# Altium project Programming Dongle.PrjPcb
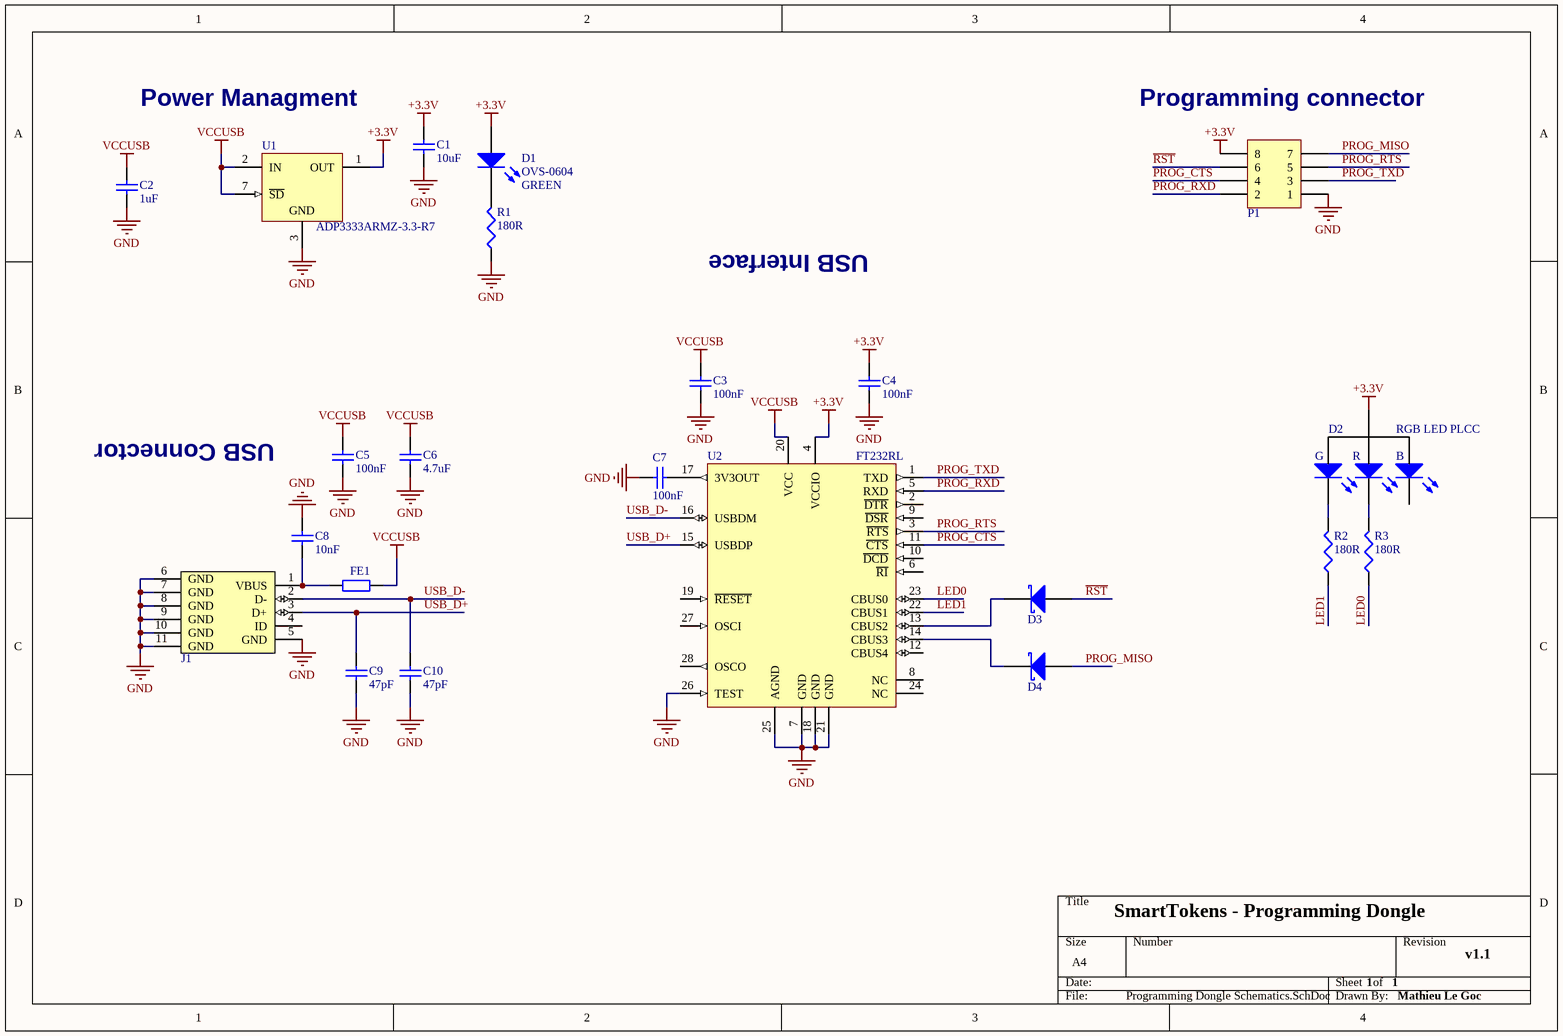
[diagram p0: Programming Dongle Schematics.SchDoc]
1 sheet, 22 parts. Net scope: global (net labels, ports and power ports of the same name join across sheets).
Board file: Programming Dongle PCB.PcbDoc

## Sheet Programming Dongle Schematics.SchDoc: SmartTokens - Programming Dongle
size A4; Author: Mathieu Le Goc; DrawnBy: Mathieu Le Goc; DocumentNumber: 1; Revision: v1.1; SheetNumber: 1; SheetTotal: 1; PageSetup: Record=PageOptions|CenterHorizontal=True|CenterVertical=True|PrintScale=1.04|XCorrection=1.00|YCorrection=1.00|PrintKind=1|BorderSize=5000000|LeftOffset=0|BottomOffset=0|Orientation=2|PaperLength=1000|PaperWidth=1000|Scale=100|PaperSource=7|PrintQuality=-4|MediaType=1|DitherType=10|PrintScaleMode=1|PaperKind=A4|PaperIndex=9

### Parts
C1  value 10uF  [0603]  (hidden comment: 10uF 0603 X5R 6.3V AVX)
C2  value 1uF  [0603]  (hidden comment: 1uF 0603 X5R 10V MULTICOMP)
C3  value 100nF  [0402]  (hidden comment: 100nF 0402 X7R 16V ±10%)
C4  value 100nF  [0402]  (hidden comment: 100nF 0402 X7R 16V ±10%)
C5  value 100nF  [0402]  (hidden comment: 100nF 0402 X7R 16V ±10%)
C6  value 4.7uF  [0603]  (hidden comment: 4.7uF 0603 X5R 10V KEMET)
C7  value 100nF  [0402]  (hidden comment: 100nF 0402 X7R 16V ±10%)
C8  value 10nF  [0402]  (hidden comment: 10nF 0402 X7R 25V KEMET)
C9  value 47pF  [0402]  (hidden comment: 47pF 0402 NP0 50V MURATA)
C10  value 47pF  [0402]  (hidden comment: 47pF 0402 NP0 50V MURATA)
D1  OVS-0604  value GREEN  [0603 - LED]
D2  RGB LED PLCC  [PLCC_4]
D3  Schottky barrier single diode  [SOD-323]  (value not drawn)
D4  Schottky barrier single diode  [SOD-323]  (value not drawn)
FE1  MURATA - BLM18PG471SN1D  [0603]  (value not drawn)
J1  MICRO USB B  [MICRO_USB_B]  (value not drawn)
P1  FTSH-104-04-F-DH  [FTSH-104-04-F-DH]  (value not drawn)
R1  value 180R  [0402]  (hidden comment: 180R 0402 1% VISHAY)
R2  value 180R  [0402]  (hidden comment: 180R 0402 1/16W ±1%)
R3  value 180R  [0402]  (hidden comment: 180R 0402 1/16W ±1%)
U1  ADP3333ARMZ-3.3-R7  [ADI-RM-8_N]
U2  FT232RL  [SSOP-28_N]

### Nets
+3.3V: C1.2 C4.2 D1.1(A) D2.3(A) P1.8 U1.1(OUT) U2.4(VCCIO)
GND: C1.1 C2.1 C3.1 C4.1 C5.1 C6.1 C7.2 C8.2 C9.1 C10.1 J1.5(GND) J1.6(GND) J1.7(GND) J1.8(GND) J1.9(GND) J1.10(GND) J1.11(GND) P1.1 R1.1 U1.3(GND) U1.4(NC) U1.5(NC) U1.6(NC) U1.8(NC) U2.7(GND) U2.18(GND) U2.21(GND) U2.25(AGND) U2.26(TEST)
VCCUSB: C2.2 C3.2 C5.2 C6.2 FE1.2 U1.2(IN) U1.7(~{SD}) U2.20(VCC)
LED0: R3.1 U2.23(CBUS0)
LED1: R2.1 U2.22(CBUS1)
PROG_CTS: P1.4 U2.11(~{CTS})
PROG_MISO: D4.2(A) P1.7
PROG_RTS: P1.5 U2.3(~{RTS})
PROG_RXD: P1.2 U2.5(RXD)
PROG_TXD: P1.3 U2.1(TXD)
~{RST}: D3.2(A) P1.6
USB_D+: C9.2 J1.3(D+) U2.15(USBDP)
USB_D-: C10.2 J1.2(D-) U2.16(USBDM)
NetC7_1: C7.1 U2.17(3V3OUT)
NetC8_1: C8.1 FE1.1 J1.1(VBUS)
NetD1_2: D1.2(K) R1.2
NetD2_1: D2.1(KR) R3.2
NetD2_2: D2.2(KG) R2.2
NetD3_1: D3.1(K) U2.13(CBUS2)
NetD4_1: D4.1(K) U2.14(CBUS3)

Not connected (* = marked no-connect by the designer): D2 4(KB); J1 4(ID); U2 2(~{DTR}) 6(~{RI}) 8(NC) 9(~{DSR}) 10(~{DCD}) 12(CBUS4) 19(~{RESET}) 24(NC) 27(OSCI) 28(OSCO)

### Notes on the sheet
- Power Managment
- (near P1) Programming connector
- USB Interface
- USB Connector
- (in symbol RGB_LED) G; R; B

### Library data of the parts
C1 = 10uF 0603 X5R 6.3V: AVX - 06036D106MAT2A - 0603 X5R 6.3V 10UF; Supplier 1: Farnell; Supplier Part Number 1: 1833804
C2 = 1uF 0603 X5R 10V: MULTICOMP - MC0603X105K100CT - MLCC 0603 X5R 10V 1UF; Supplier 1: Farnell; Supplier Part Number 1: 1759399
C3-C5 C7 = 100nF (cheap): Supplier 1: Farnell; Supplier Part Number 1: 1288252; Supplier 2: Digi-Key; Supplier Part Number 2: 399-3521-1-ND
C6 = 4.7uF 0603 X5R 10V: KEMET - C0603C475K8PACTU - CONDENSATEUR 4.7UF 10V X5R 0603; Supplier 1: Farnell; Supplier Part Number 1: 1572625
C8 = 10nF 0402 X7R 25V: KEMET - C0402C103J3RACTU - MLCC 0402 25V 0.01UF; Supplier 1: Farnell; Supplier Part Number 1: 1692285
C9 C10 = 47pF 0402 NP0 50V: MURATA - GRM1555C1H470JZ01D - 0402 47PF 50V; Supplier 1: Farnell; Supplier Part Number 1: 8819670
D1 = LED GREEN: MULTICOMP - OVS-0604 - LED, 0603, GREEN, 300MCD, 520NM; Supplier 1: Farnell; Supplier Part Number 1: 1716771
D2 = RGB_LED: MULTICOMP - 703-1028 - LED RGB 3528 PLCC; Supplier 1: Farnell; Supplier Part Number 1: 2112143
D3 D4 = 1PS76SB10: NXP - 1PS76SB10; Supplier 1: Farnell; Supplier Part Number 1: 1081179
FE1 = FERRITE: Ferrite Bead (470R ~ 100MHz); Supplier 1: Farnell; Supplier Part Number 1: 1515745
J1 = MICRO_USB_B: MOLEX - 47346-0001 - FEMALE MICRO USB B BOTTOM MOUNT; Supplier 1: Farnell; Supplier Part Number 1: 1568026
P1 = FTSH-104-04-F-DH: Samtec FTSH 4x2 .050" Horizontal SMD
R1 = 180R 0402 1%: VISHAY DRALORIC - CRCW0402180RFKED - 0402 180R 1%; Supplier 1: Farnell; Supplier Part Number 1: 2140698
R2 R3 = 180R: Supplier 1: Farnell; Supplier Part Number 1: 2140698; Supplier 2: Digi-Key; Supplier Part Number 2: 541-180LCT-ND
U1 = ADP3333ARMZ-3.3-R7: High Accuracy Ultralow IQ, 300 mA, anyCAP Low Dropout Regulator, 2.6 to 12 V Vin, 3.3 V Vout, Industrial, 8-pin SOP (RM-8), Reel; Manufacturer: Analog Devices; Iout max: 300mA; Preset Vout Values (V): 3.3; Supply Current IGND @ Small Load: 70uA; Vin (max) (V): 12; Vin (min) (V): 2.6; DatasheetVersion: Rev. B; PackageVersion: Aug-05; PackageReference: RM-8; PackageDescription: 8-Pin Mini Small Outline Package, Body 3 x 3 mm, Pitch 0.65 mm; Supplier 1: Digi-Key; Supplier Part Number 1: ADP3333ARMZ-3.3-R7TR-ND; Supplier 2: Digi-Key; Supplier Part Number 2: ADP3333ARMZ-3.3-R7CT-ND; Supplier 3: Digi-Key; Supplier Part Number 3: ADP3333ARMZ-3.3-R7DKR-ND; Supplier 4: Farnell; Supplier Part Number 4: 2074872; Supplier 5: Farnell; Supplier Part Number 5: 2074872RL; Supplier 6: Newark; Supplier Part Number 6: 61M3992; Supplier 7: Newark; Supplier Part Number 7: 67W2712; Supplier 8: Mouser; Supplier Part Number 8: 584-ADP3333ARMZ3.3R7; Packing: Reel; Mounting Technology: Surface Mount; Code_JEDEC: MO-187-AA; PartNumber: ADP3333ARMZ-3.3-R7; ComponentLink1Description: Manufacturer URL; ComponentLink1URL: http://www.analog.com/en/index.html; ComponentLink2Description: Datasheet; ComponentLink2URL: http://www.analog.com/static/imported-files/data_sheets/ADP3333.pdf; ComponentLink3Description: Package Specification; ComponentLink3URL: http://www.analog.com/static/imported-files/packages/PKG_PDF/MSOP%28RM%29/RM_8.pdf; ComponentLink4Description: URL Link1; ComponentLink4URL: Product URL:http://www.analog.com/en/ADP3333/productSearch.html
U2 = FT232RL: USB UART Asynchronous Serial Data Transfer Chip, SSOP-28, Tape and Reel; Published: 19-Aug-2010; DatasheetVersion: ver 2.07, Jul-2010; PackageVersion: 2010; PackageReference: SSOP-28; Publisher: Altium Limited; PackageDescription: 28-Pin Small Outline Package 0.65 mm Pitch; ComponentLink1Description: Manufacturer Link; ComponentLink1URL: http://www.ftdichip.com/Products/ICs/FT232R.htm; ComponentLink2Description: Datasheet; ComponentLink2URL: http://www.ftdichip.com/Support/Documents/DataSheets/ICs/DS_FT232R.pdf; Supplier 1: Farnell; Supplier Part Number 1: 1146032